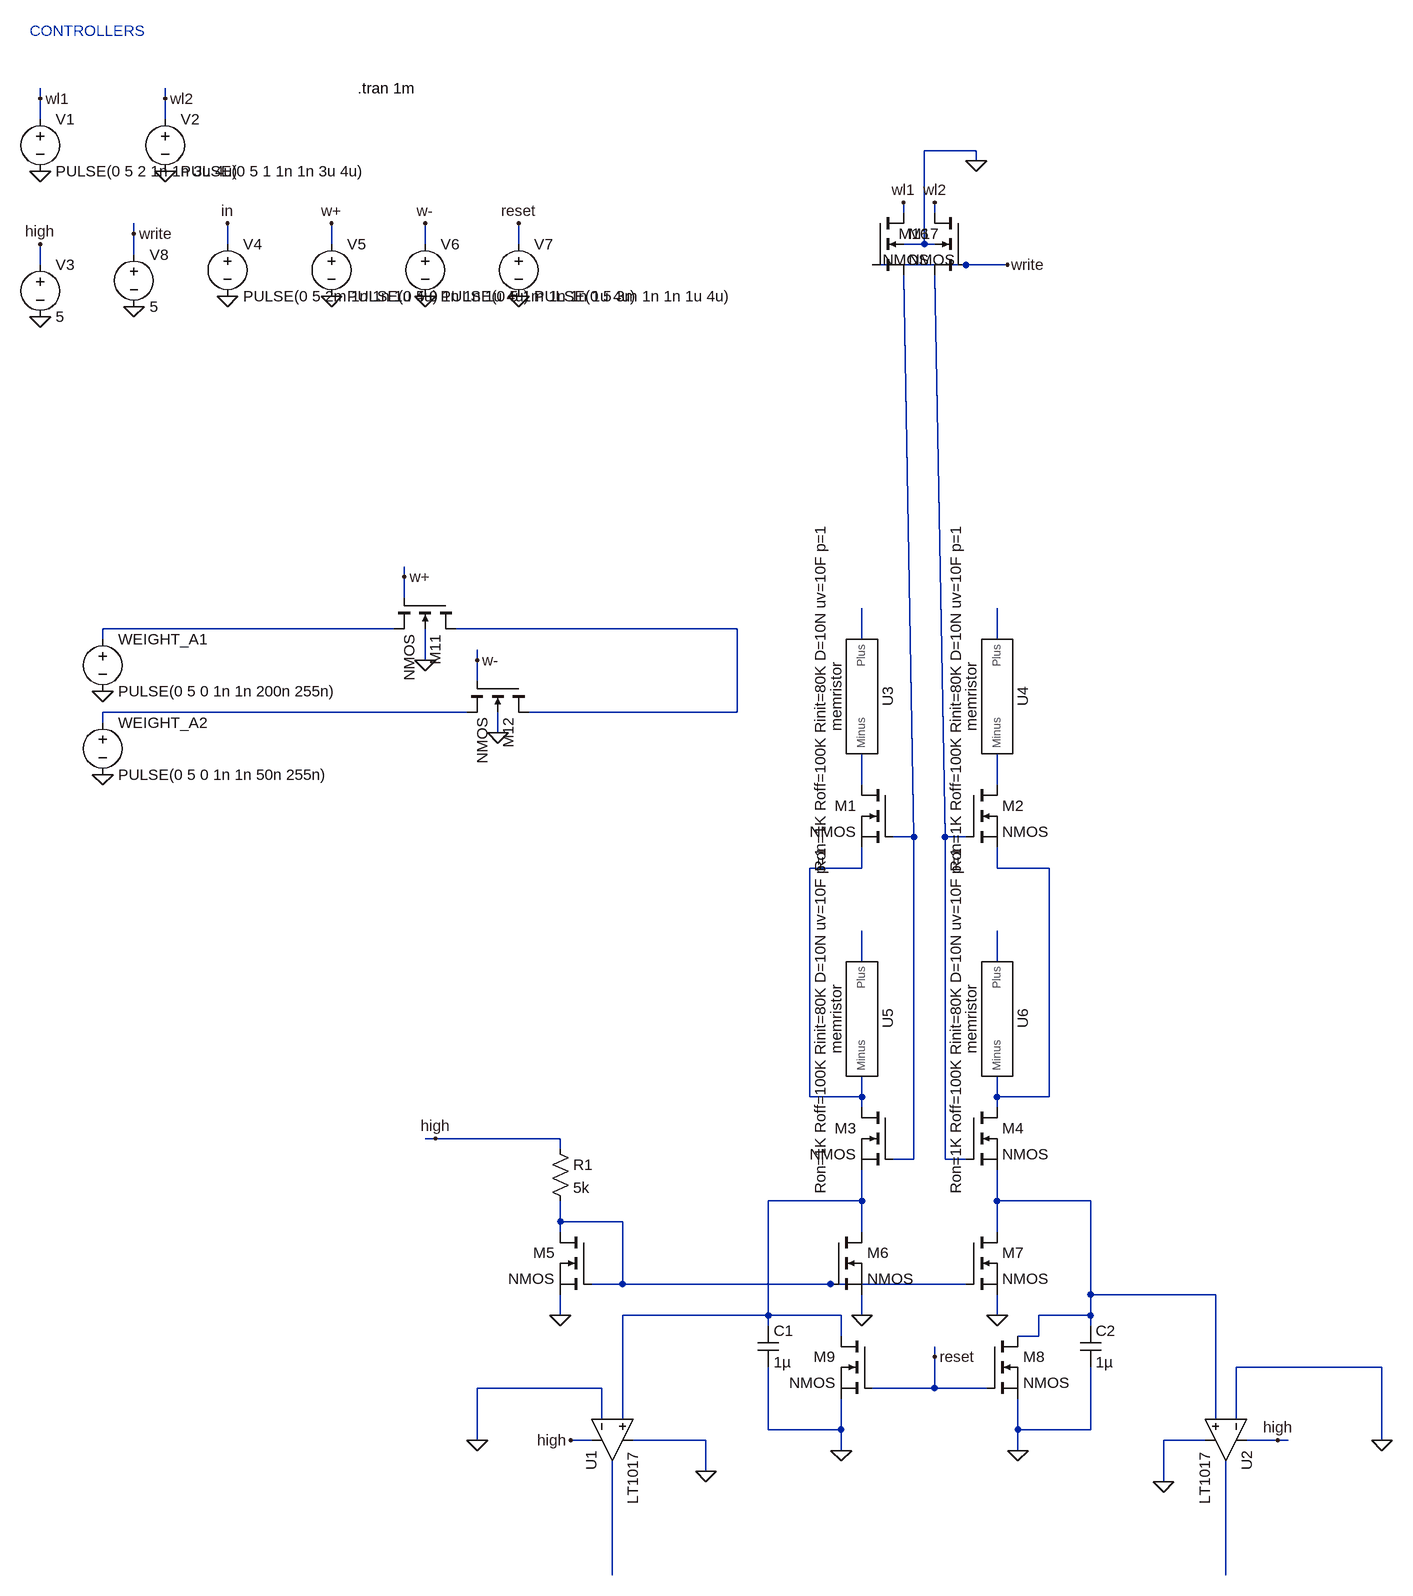
[diagram p0: schematic Draft1.asc]
Draft1.asc, the LTspice schematic file:
Version 4
SHEET 1 2060 1428
WIRE -864 -848 -864 -864
WIRE -672 -848 -672 -864
WIRE -864 -816 -864 -848
WIRE -672 -816 -672 -848
WIRE 576 -768 496 -768
WIRE 576 -752 576 -768
WIRE 464 -672 464 -688
WIRE 512 -672 512 -688
WIRE -720 -640 -720 -656
WIRE -576 -624 -576 -656
WIRE -416 -624 -416 -656
WIRE -272 -624 -272 -656
WIRE -128 -624 -128 -656
WIRE 496 -624 496 -768
WIRE 496 -624 464 -624
WIRE 512 -624 496 -624
WIRE -720 -608 -720 -640
WIRE -864 -592 -864 -624
WIRE 560 -592 416 -592
WIRE 624 -592 560 -592
WIRE -304 -112 -304 -128
WIRE -304 -80 -304 -112
WIRE -320 -32 -768 -32
WIRE 208 -32 -224 -32
WIRE -768 -16 -768 -32
WIRE 400 -16 400 -64
WIRE 608 -16 608 -64
WIRE -272 16 -272 -32
WIRE -192 16 -192 0
WIRE -192 48 -192 16
WIRE -208 96 -768 96
WIRE 208 96 208 -32
WIRE 208 96 -112 96
WIRE -768 112 -768 96
WIRE -160 128 -160 96
WIRE 400 208 400 160
WIRE 608 208 608 160
WIRE 480 288 464 -576
WIRE 480 288 448 288
WIRE 528 288 512 -576
WIRE 560 288 528 288
WIRE 400 336 400 304
WIRE 400 336 320 336
WIRE 608 336 608 304
WIRE 688 336 608 336
WIRE 400 480 400 432
WIRE 608 480 608 432
WIRE 320 688 320 336
WIRE 400 688 400 656
WIRE 400 688 320 688
WIRE 608 688 608 656
WIRE 688 688 688 336
WIRE 688 688 608 688
WIRE 400 704 400 688
WIRE 608 704 608 688
WIRE -256 752 -272 752
WIRE -64 752 -256 752
WIRE -64 768 -64 752
WIRE 480 784 480 288
WIRE 480 784 448 784
WIRE 528 784 528 288
WIRE 560 784 528 784
WIRE 400 848 400 800
WIRE 400 848 256 848
WIRE 608 848 608 800
WIRE 752 848 608 848
WIRE -64 880 -64 848
WIRE 32 880 -64 880
WIRE -64 896 -64 880
WIRE 400 896 400 848
WIRE 608 896 608 848
WIRE 32 976 32 880
WIRE 32 976 -16 976
WIRE 352 976 32 976
WIRE 560 976 352 976
WIRE 752 992 752 848
WIRE 944 992 752 992
WIRE -64 1024 -64 992
WIRE 256 1024 256 848
WIRE 256 1024 32 1024
WIRE 368 1024 256 1024
WIRE 400 1024 400 992
WIRE 608 1024 608 992
WIRE 752 1024 752 992
WIRE 752 1024 672 1024
WIRE 256 1040 256 1024
WIRE 752 1040 752 1024
WIRE 368 1056 368 1024
WIRE 672 1056 672 1024
WIRE 672 1056 640 1056
WIRE 512 1088 512 1072
WIRE 1200 1104 976 1104
WIRE 0 1136 -192 1136
WIRE 512 1136 512 1088
WIRE 512 1136 416 1136
WIRE 592 1136 512 1136
WIRE 0 1184 0 1136
WIRE 32 1184 32 1024
WIRE 944 1184 944 992
WIRE 976 1184 976 1104
WIRE 256 1200 256 1104
WIRE 368 1200 368 1152
WIRE 368 1200 256 1200
WIRE 640 1200 640 1152
WIRE 752 1200 752 1104
WIRE 752 1200 640 1200
WIRE -192 1216 -192 1136
WIRE -16 1216 -48 1216
WIRE 160 1216 48 1216
WIRE 928 1216 864 1216
WIRE 1040 1216 992 1216
WIRE 1056 1216 1040 1216
WIRE 1200 1216 1200 1104
WIRE 368 1232 368 1200
WIRE 640 1232 640 1200
WIRE 160 1264 160 1216
WIRE 864 1280 864 1216
WIRE 16 1424 16 1248
WIRE 960 1424 960 1248
FLAG -864 -736 0
FLAG -864 -848 wl1
FLAG -672 -736 0
FLAG -672 -848 wl2
FLAG 400 1024 0
FLAG -64 1024 0
FLAG 608 1024 0
FLAG 640 1232 0
FLAG 368 1232 0
FLAG 160 1264 0
FLAG 864 1280 0
FLAG -864 -512 0
FLAG -864 -624 high
FLAG 1040 1216 high
FLAG -48 1216 high
FLAG -192 1216 0
FLAG 1200 1216 0
FLAG -256 752 high
FLAG -768 64 0
FLAG -768 192 0
FLAG -576 -544 0
FLAG -416 -544 0
FLAG -272 -544 0
FLAG -576 -656 in
FLAG -272 -656 w-
FLAG -416 -656 w+
FLAG -304 -112 w+
FLAG -192 16 w-
FLAG 512 1088 reset
FLAG -272 16 0
FLAG -160 128 0
FLAG -128 -544 0
FLAG -128 -656 reset
FLAG 464 -688 wl1
FLAG 512 -688 wl2
FLAG 576 -752 0
FLAG -720 -528 0
FLAG -720 -640 write
FLAG 624 -592 write
SYMBOL nmos 448 208 M0
SYMATTR InstName M1
SYMBOL nmos 560 208 R0
SYMATTR InstName M2
SYMBOL nmos 448 704 M0
SYMATTR InstName M3
SYMBOL nmos 560 704 R0
SYMATTR InstName M4
SYMBOL Voltage -864 -832 R0
SYMATTR InstName V1
SYMATTR Value PULSE(0 5 2 1n 1n 3u 4u)
SYMBOL Voltage -672 -832 R0
SYMATTR InstName V2
SYMATTR Value PULSE(0 5 1 1n 1n 3u 4u)
SYMBOL nmos -16 896 M0
SYMATTR InstName M5
SYMBOL nmos 352 896 R0
SYMATTR InstName M6
SYMBOL nmos 560 896 R0
SYMATTR InstName M7
SYMBOL Res -80 752 R0
SYMATTR InstName R1
SYMATTR Value 5k
SYMBOL Cap 240 1040 R0
SYMATTR InstName C1
SYMATTR Value 1µ
SYMBOL Cap 736 1040 R0
SYMATTR InstName C2
SYMATTR Value 1µ
SYMBOL nmos 592 1056 R0
SYMATTR InstName M8
SYMBOL nmos 416 1056 M0
SYMATTR InstName M9
SYMBOL LT1017 16 1216 M90
SYMATTR InstName U1
SYMBOL LT1017 960 1216 R90
SYMATTR InstName U2
SYMBOL Voltage -864 -608 R0
SYMATTR InstName V3
SYMATTR Value 5
SYMBOL Voltage -768 -32 R0
SYMATTR InstName WEIGHT_A1
SYMATTR Value PULSE(0 5 0 1n 1n 200n 255n)
SYMBOL Voltage -768 96 R0
SYMATTR InstName WEIGHT_A2
SYMATTR Value PULSE(0 5 0 1n 1n 50n 255n)
SYMBOL Voltage -576 -640 R0
SYMATTR InstName V4
SYMATTR Value PULSE(0 5 2m 1n 1n 1u 4u)
SYMBOL Voltage -416 -640 R0
SYMATTR InstName V5
SYMATTR Value PULSE(0 5 0 1n 1n 1u 4u)
SYMBOL Voltage -272 -640 R0
SYMATTR InstName V6
SYMATTR Value PULSE(0 5 1m 1n 1n 1u 4u)
SYMBOL nmos4 -224 -80 R90
SYMATTR InstName M11
SYMBOL nmos4 -112 48 R90
SYMATTR InstName M12
SYMBOL Voltage -128 -640 R0
SYMATTR InstName V7
SYMATTR Value PULSE(0 5 3m 1n 1n 1u 4u)
SYMBOL nmos4 560 -672 M0
SYMATTR InstName M16
SYMBOL nmos4 416 -672 R0
SYMATTR InstName M17
SYMBOL Voltage -720 -624 R0
SYMATTR InstName V8
SYMATTR Value 5
SYMBOL memristor 400 64 R90
SYMATTR InstName U3
SYMBOL memristor 608 64 R90
SYMATTR InstName U4
SYMBOL memristor 400 560 R90
SYMATTR InstName U5
SYMBOL memristor 608 560 R90
SYMATTR InstName U6
TEXT -376 -864 Left 2 !.tran 1m
TEXT -880 -952 Left 2 ;CONTROLLERS

The netlist it stands for:
* Draft1.asc
M1 N006 N008 N010 N010 NMOS
M2 N007 N009 N011 N011 NMOS
M3 N010 N008 N014 N014 NMOS
M4 N011 N009 N015 N015 NMOS
V1 wl1 0 PULSE(0 5 2 1n 1n 3u 4u)
V2 wl2 0 PULSE(0 5 1 1n 1n 3u 4u)
M5 N016 N016 0 0 NMOS
M6 N014 N016 0 0 NMOS
M7 N015 N016 0 0 NMOS
R1 high N016 5k
C1 N014 0 1µ
C2 N015 0 1µ
M8 N015 reset 0 0 NMOS
M9 N014 reset 0 0 NMOS
XU1 N014 0 high 0 N017 LT1017  ; pins In+ In- V+ V- OUT
XU2 N015 0 high 0 N018 LT1017  ; pins In+ In- V+ V- OUT
V3 high 0 5
V§WEIGHT_A1 N001 0 PULSE(0 5 0 1n 1n 200n 255n)
V§WEIGHT_A2 N005 0 PULSE(0 5 0 1n 1n 50n 255n)
V4 in 0 PULSE(0 5 2m 1n 1n 1u 4u)
V5 w+ 0 PULSE(0 5 0 1n 1n 1u 4u)
V6 w- 0 PULSE(0 5 1m 1n 1n 1u 4u)
M11 N002 w+ N001 0 NMOS
M12 N002 w- N005 0 NMOS
V7 reset 0 PULSE(0 5 3m 1n 1n 1u 4u)
M16 wl2 write N009 0 NMOS
M17 wl1 write N008 0 NMOS
V8 write 0 5
XU3 N003 N006 memristor Ron=1K Roff=100K Rinit=80K D=10N uv=10F p=1  ; pins Plus Minus
XU4 N004 N007 memristor Ron=1K Roff=100K Rinit=80K D=10N uv=10F p=1  ; pins Plus Minus
XU5 N012 N010 memristor Ron=1K Roff=100K Rinit=80K D=10N uv=10F p=1  ; pins Plus Minus
XU6 N013 N011 memristor Ron=1K Roff=100K Rinit=80K D=10N uv=10F p=1  ; pins Plus Minus
.model NMOS NMOS
.model PMOS PMOS
.lib standard.mos
.tran 1m
* CONTROLLERS
.lib D:\Chip Design Studio IIITB\Memristor\memristor.lib.cir
.backanno
.end